# EAGLE design Connector Board (EAGLE 8.0.1)
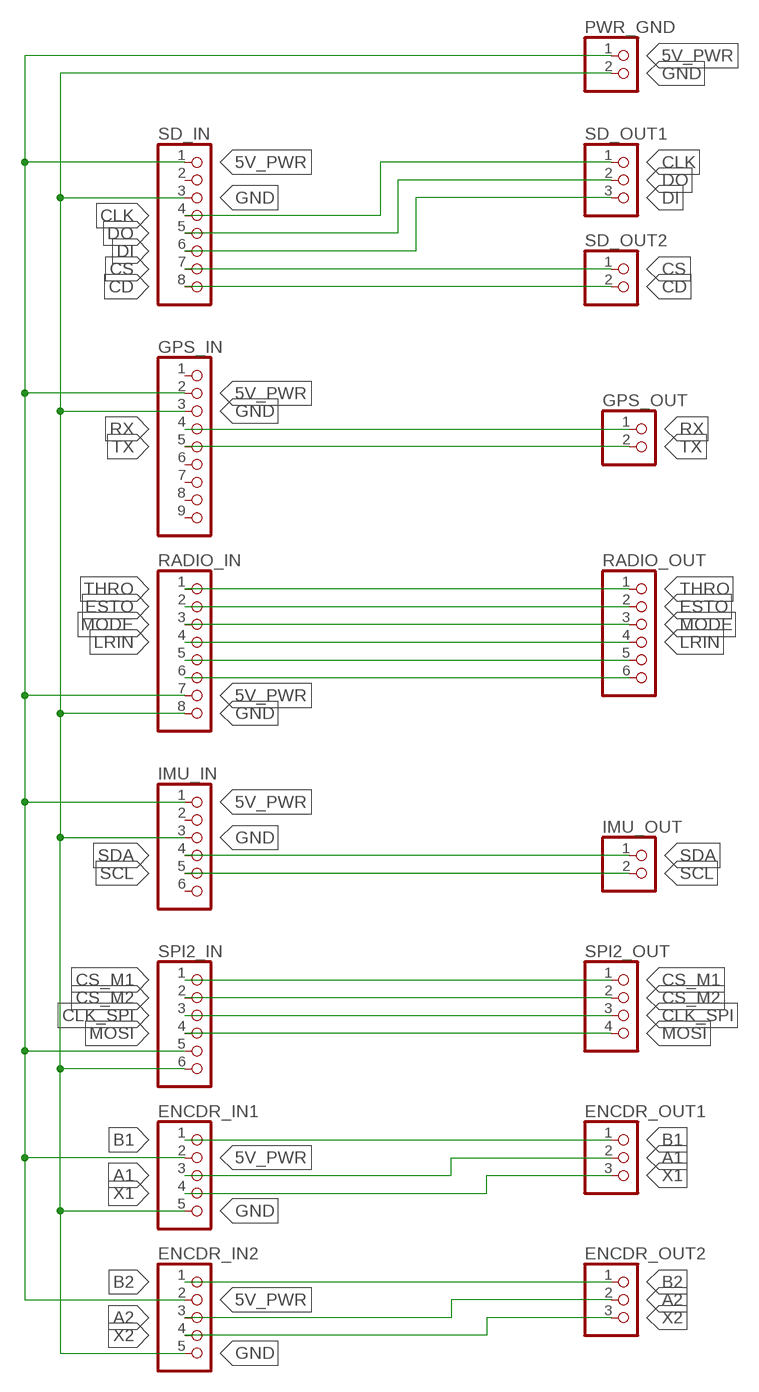
[diagram p0: schematic, sheet 1]

## Parts
ENCDR_IN1  PINHD-1X5  [1X05]
ENCDR_IN2  PINHD-1X5  [1X05]
ENCDR_OUT1  PINHD-1X3  [1X03]
ENCDR_OUT2  PINHD-1X3  [1X03]
GPS_IN  PINHD-1X9  [1X09]
GPS_OUT  PINHD-1X2  [1X02]
IMU_IN  PINHD-1X6  [1X06]
IMU_OUT  PINHD-1X2  [1X02]
PWR_GND  PINHD-1X2  [1X02]
RADIO_IN  PINHD-1X8  [1X08]
RADIO_OUT  PINHD-1X6  [1X06]
SD_IN  PINHD-1X8  [1X08]
SD_OUT1  PINHD-1X3  [1X03]
SD_OUT2  PINHD-1X2  [1X02]
SPI2_IN  PINHD-1X6  [1X06]
SPI2_OUT  PINHD-1X4  [1X04]

## Nets
5V_PWR: ENCDR_IN1.2 ENCDR_IN2.2 GPS_IN.2 IMU_IN.1 PWR_GND.1 RADIO_IN.7 SD_IN.1 SPI2_IN.5
A1: ENCDR_IN1.3 ENCDR_OUT1.2
A2: ENCDR_IN2.3 ENCDR_OUT2.2
B1: ENCDR_IN1.1 ENCDR_OUT1.1
B2: ENCDR_IN2.1 ENCDR_OUT2.1
CD: SD_IN.8 SD_OUT2.2
CLK: SD_IN.4 SD_OUT1.1
CLK_SPI: SPI2_IN.3 SPI2_OUT.3
CS: SD_IN.7 SD_OUT2.1
CS_M1: SPI2_IN.1 SPI2_OUT.1
CS_M2: SPI2_IN.2 SPI2_OUT.2
DI: SD_IN.6 SD_OUT1.3
DO: SD_IN.5 SD_OUT1.2
ESTO: RADIO_IN.2 RADIO_OUT.2
GND: ENCDR_IN1.5 ENCDR_IN2.5 GPS_IN.3 IMU_IN.3 PWR_GND.2 RADIO_IN.8 SD_IN.3 SPI2_IN.6
LRIN: RADIO_IN.4 RADIO_OUT.4
MODE: RADIO_IN.3 RADIO_OUT.3
MOSI: SPI2_IN.4 SPI2_OUT.4
N$1: RADIO_IN.5 RADIO_OUT.5
N$2: RADIO_IN.6 RADIO_OUT.6
RX: GPS_IN.4 GPS_OUT.1
SCL: IMU_IN.5 IMU_OUT.2
SDA: IMU_IN.4 IMU_OUT.1
THRO: RADIO_IN.1 RADIO_OUT.1
TX: GPS_IN.5 GPS_OUT.2
X1: ENCDR_IN1.4 ENCDR_OUT1.3
X2: ENCDR_IN2.4 ENCDR_OUT2.3
Unconnected: GPS_IN.1 GPS_IN.6 GPS_IN.7 GPS_IN.8 GPS_IN.9 IMU_IN.2 IMU_IN.6 SD_IN.2

## Library data of the parts
ENCDR_IN1 ENCDR_IN2 = pinhead:PINHD-1X5: PIN HEADER
ENCDR_OUT1 ENCDR_OUT2 SD_OUT1 = pinhead:PINHD-1X3: PIN HEADER
GPS_IN = pinhead:PINHD-1X9: PIN HEADER
GPS_OUT IMU_OUT PWR_GND SD_OUT2 = pinhead:PINHD-1X2: PIN HEADER
IMU_IN RADIO_OUT SPI2_IN = pinhead:PINHD-1X6: PIN HEADER
RADIO_IN SD_IN = pinhead:PINHD-1X8: PIN HEADER
SPI2_OUT = pinhead:PINHD-1X4: PIN HEADER

## Net classes
0 default: width 0.305 mm, drill 0.508 mm, clearance 0.254 mm

## Board
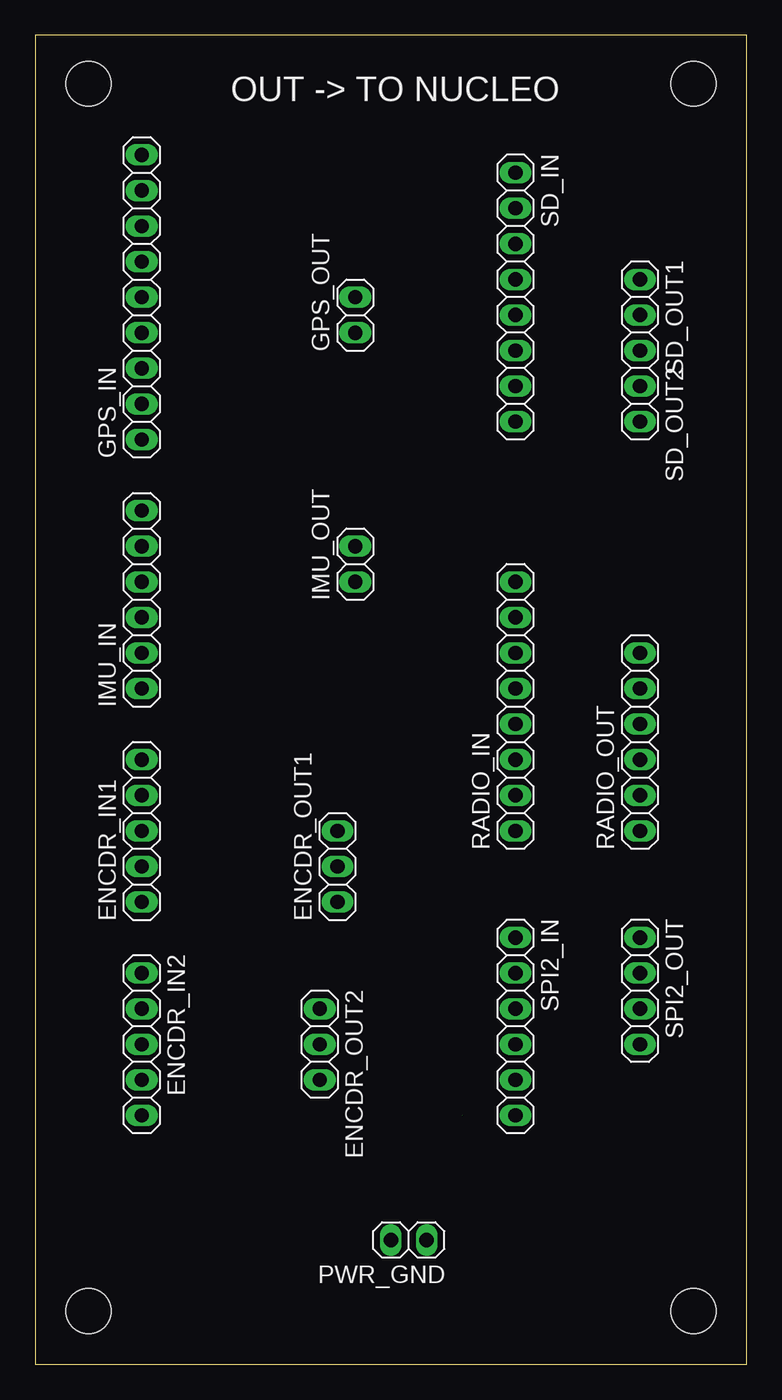
[diagram p1: board, top side]
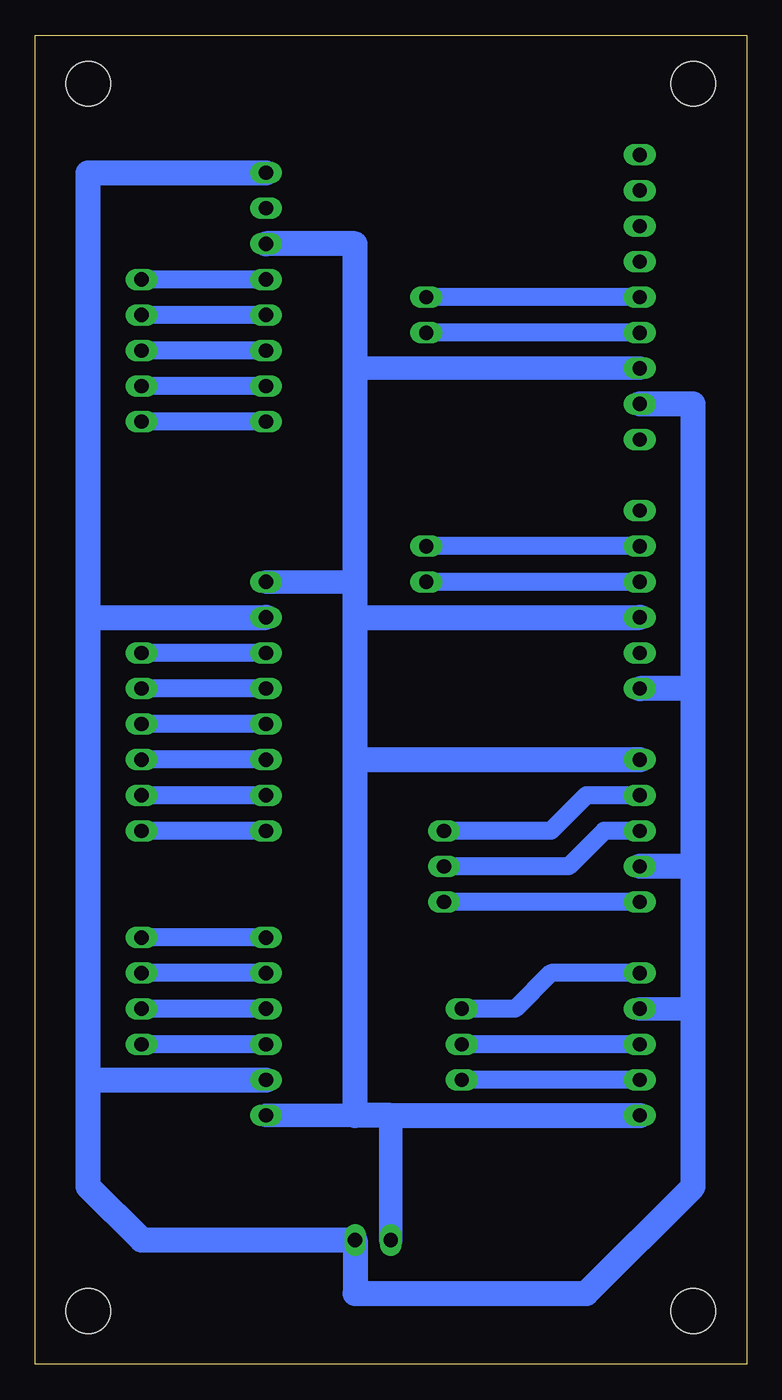
[diagram p2: board, bottom side, seen from below]

Size 50.78 x 94.92 mm. Coordinates in mm from the lower left corner, seen from the top.
Outline: 0,0 50.78,0 50.78,94.92 0,94.92 0,0
Copper layers (1*16): Top 0.035mm / dielectric 1.5mm / Bottom 0.035mm
Design rules "OthermillDRC_1_32_v2": minimum track width 8mil, minimum drill 0.8mm, track to track 0.794003125mm, track to pad 0.794003125mm, pad to pad 0.794003125mm, via to via 0.794003125mm, smd to smd 0mil, copper to edge 0mil, drill to drill 1mil, minimum pad ring 10mil, minimum via ring 10mil, stop-mask expansion 1mil, vias tented up to drill 30mil, thermal gap 10mil
Holes 3.2 mm at 3.81,91.44 46.99,91.44 46.99,3.81 3.81,3.81

### Footprints (pad centres in the part's own frame; a part is rotated, then mirrored left to right if it is on the bottom)
1X05 = drill 1.016 long: 1 -5.08,0; 2 -2.54,0; 3 0,0; 4 2.54,0; 5 5.08,0
1X03 = drill 1.016 long: 1 -2.54,0; 2 0,0; 3 2.54,0
1X09 = drill 1.016 long: 1 -10.16,0; 2 -7.62,0; 3 -5.08,0; 4 -2.54,0; 5 0,0; 6 2.54,0; 7 5.08,0; 8 7.62,0; 9 10.16,0
1X02 = drill 1.016 long: 1 -1.27,0; 2 1.27,0
1X06 = drill 1.016 long: 1 -6.35,0; 2 -3.81,0; 3 -1.27,0; 4 1.27,0; 5 3.81,0; 6 6.35,0
1X08 = drill 1.016 long: 1 -8.89,0; 2 -6.35,0; 3 -3.81,0; 4 -1.27,0; 5 1.27,0; 6 3.81,0; 7 6.35,0; 8 8.89,0
1X04 = drill 1.016 long: 1 -3.81,0; 2 -1.27,0; 3 1.27,0; 4 3.81,0

### Placement (x,y rotation side)
ENCDR_IN1  7.62,38.1 90 top
ENCDR_IN2  7.62,22.86 270 top
ENCDR_OUT1  21.59,35.56 90 top
ENCDR_OUT2  20.32,22.86 270 top
GPS_IN  7.62,76.2 90 top
GPS_OUT  22.86,74.93 90 top
IMU_IN  7.62,54.61 90 top
IMU_OUT  22.86,57.15 90 top
PWR_GND  26.67,8.89 180 top
RADIO_IN  34.29,46.99 90 top
RADIO_OUT  43.18,44.45 90 top
SD_IN  34.29,76.2 270 top
SD_OUT1  43.18,74.93 270 top
SD_OUT2  43.18,68.58 270 top
SPI2_IN  34.29,24.13 270 top
SPI2_OUT  43.18,26.67 270 top

### Tracks (layer width: path | path; a pad name or v marks a point on that pad's centre or on a via)
5V_PWR
  Bottom 1.676: 3.81,25.4 ENCDR_IN2.2
  Bottom 1.778: 3.81,35.56 3.81,25.4 3.81,12.7 11.43,5.08 27.94,5.08 PWR_GND.1 43.18,8.89 46.99,12.7 46.99,20.32 | 3.81,35.56 ENCDR_IN1.2 | 3.81,35.56 3.81,48.26 | 3.81,48.26 IMU_IN.1 | 3.81,48.26 3.81,68.58 GPS_IN.2 | 46.99,20.32 SPI2_IN.5 | 46.99,20.32 46.99,53.34 | 46.99,53.34 RADIO_IN.7 | 46.99,53.34 46.99,85.09 SD_IN.1
A1
  Bottom 1.27: ENCDR_IN1.3 10.16,38.1 12.7,35.56 ENCDR_OUT1.2
A2
  Bottom 1.27: ENCDR_IN2.3 ENCDR_OUT2.2
B1
  Bottom 1.27: ENCDR_IN1.1 ENCDR_OUT1.1
B2
  Bottom 1.27: ENCDR_IN2.1 13.97,27.94 16.51,25.4 ENCDR_OUT2.1
CD
  Bottom 1.27: SD_IN.8 SD_OUT2.2
CLK
  Bottom 1.27: SD_IN.4 SD_OUT1.1
CLK_SPI
  Bottom 1.27: SPI2_IN.3 SPI2_OUT.3
CS
  Bottom 1.27: SD_IN.7 SD_OUT2.1
CS_M1
  Bottom 1.27: SPI2_IN.1 SPI2_OUT.1
CS_M2
  Bottom 1.27: SPI2_IN.2 SPI2_OUT.2
DI
  Bottom 1.27: SD_IN.6 SD_OUT1.3
DO
  Bottom 1.27: SD_IN.5 SD_OUT1.2
ESTO
  Bottom 1.27: RADIO_IN.2 RADIO_OUT.2
GND  (1 unrouted)
  Bottom 1.676: PWR_GND.2 25.4,17.78 | 27.94,17.78 SPI2_IN.6 | 27.94,55.88 RADIO_IN.8 | 27.94,71.12 GPS_IN.3
  Bottom 1.778: ENCDR_IN2.5 25.4,17.78 27.94,17.78 27.94,43.18 | 27.94,43.18 ENCDR_IN1.5 | 27.94,43.18 27.94,53.34 | 27.94,53.34 27.94,55.88 27.94,71.12 27.94,80.01 SD_IN.3 | 27.94,53.34 IMU_IN.3
LRIN
  Bottom 1.27: RADIO_IN.4 RADIO_OUT.4
MODE
  Bottom 1.27: RADIO_IN.3 RADIO_OUT.3
MOSI
  Bottom 1.27: SPI2_IN.4 SPI2_OUT.4
N$1
  Bottom 1.27: RADIO_IN.5 RADIO_OUT.5
N$2
  Bottom 1.27: RADIO_IN.6 RADIO_OUT.6
RX
  Bottom 1.27: GPS_IN.4 GPS_OUT.1
SCL
  Bottom 1.27: IMU_IN.5 IMU_OUT.2
SDA
  Bottom 1.27: IMU_IN.4 IMU_OUT.1
THRO
  Bottom 1.27: RADIO_IN.1 RADIO_OUT.1
TX
  Bottom 1.27: GPS_IN.5 GPS_OUT.2
X1
  Bottom 1.27: ENCDR_IN1.4 11.43,40.64 13.97,38.1 ENCDR_OUT1.3
X2
  Bottom 1.27: ENCDR_IN2.4 ENCDR_OUT2.3

### Text on the board
tPlace: OUT -> TO NUCLEO